# EAGLE design the_mill (EAGLE 7.1.0)
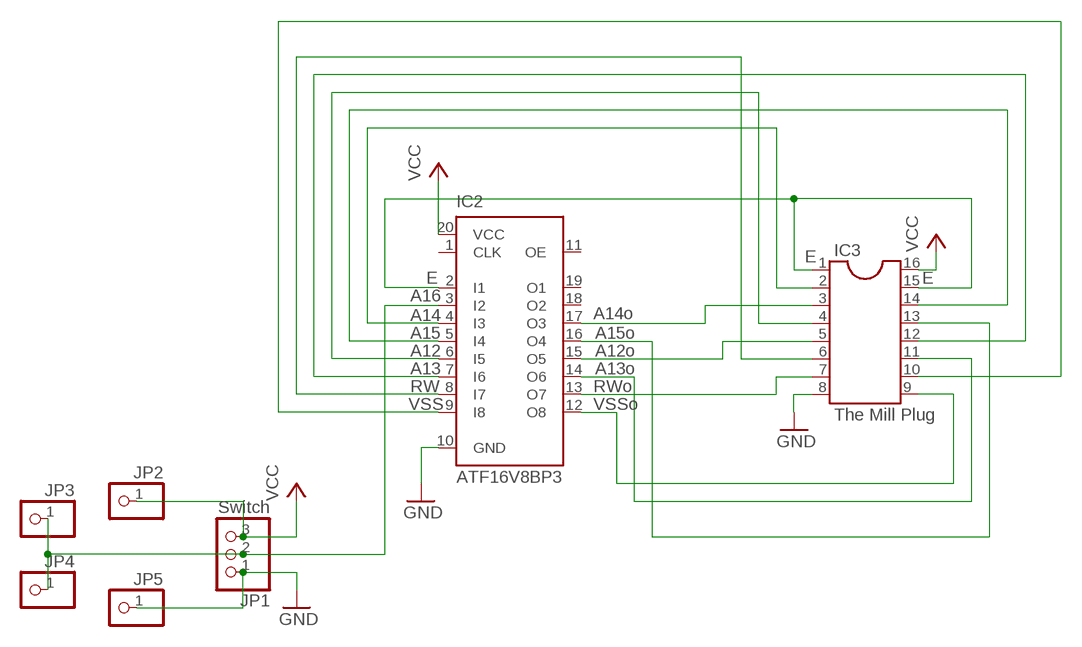
[diagram p0: schematic, sheet 1]

## Parts
IC2  ATF16V8BP3  [DIL20]
IC3  The Mill Plug  DIL16  [DIL16]
JP1  Switch  PINHD-1X3  [1X03]
JP2  PINHD-1X1  [1X01]
JP3  PINHD-1X1  [1X01]
JP4  PINHD-1X1  [1X01]
JP5  PINHD-1X1  [1X01]

## Nets
GND: IC2.10(GND) IC3.8 JP1.1 JP5.1
N$1: IC2.4(I3) IC3.2
N$2: IC2.5(I4) IC3.14
N$3: IC2.2(I1) IC3.1 IC3.15
N$4: IC2.6(I5) IC3.4
N$5: IC2.7(I6) IC3.12
N$6: IC2.3(I2) JP1.2 JP3.1 JP4.1
N$7: IC2.8(I7) IC3.6
N$8: IC2.9(I8) IC3.10
N$9: IC2.12(O8) IC3.9
N$10: IC2.13(O7) IC3.7
N$11: IC2.14(O6) IC3.11
N$12: IC2.15(O5) IC3.5
N$13: IC2.16(O4) IC3.13
N$14: IC2.17(O3) IC3.3
VCC: IC2.20(VCC) IC3.16 JP1.3 JP2.1
Unconnected: IC2.1(CLK) IC2.11(OE) IC2.18(O2) IC2.19(O1)

## Notes on the sheet
- E
- E | E
- A16
- A14 | A14o
- A15 | A15o
- A12 | A12o
- A13 | A13o
- RW | RWo
- VSS | VSSo

## Library data of the parts
IC2 = atmel:ATF16V8B: High perfomance CMOS (electrically erasable) programmable logic device (PLD) ABLE-Atmel-ABEL - P18V8R, P16V8C, P16V8AS, P17V8 COPL Atmel-WinCUPL - G16V8MS, G16V8MA, G16V8AS, G16V8 LOG/IC - GAL16V8_R, GAL16V8_G7, GAL16V8_C), GAL16V8 Tango-PLD - G16V8R, G16V8C, G16V8AS, G16V8 Source: http://www.atmel.com/dyn/resources/prod_documents/DOC0364.PDF; MPN: ATF16V8CZ-15PU; OC_FARNELL: 1551768; OC_NEWARK: 94M6254
IC3 = ic-package:DIL16: Dual In Line / Socket
JP1 = pinhead:PINHD-1X3: PIN HEADER
JP2-JP5 = pinhead:PINHD-1X1: PIN HEADER

## Board
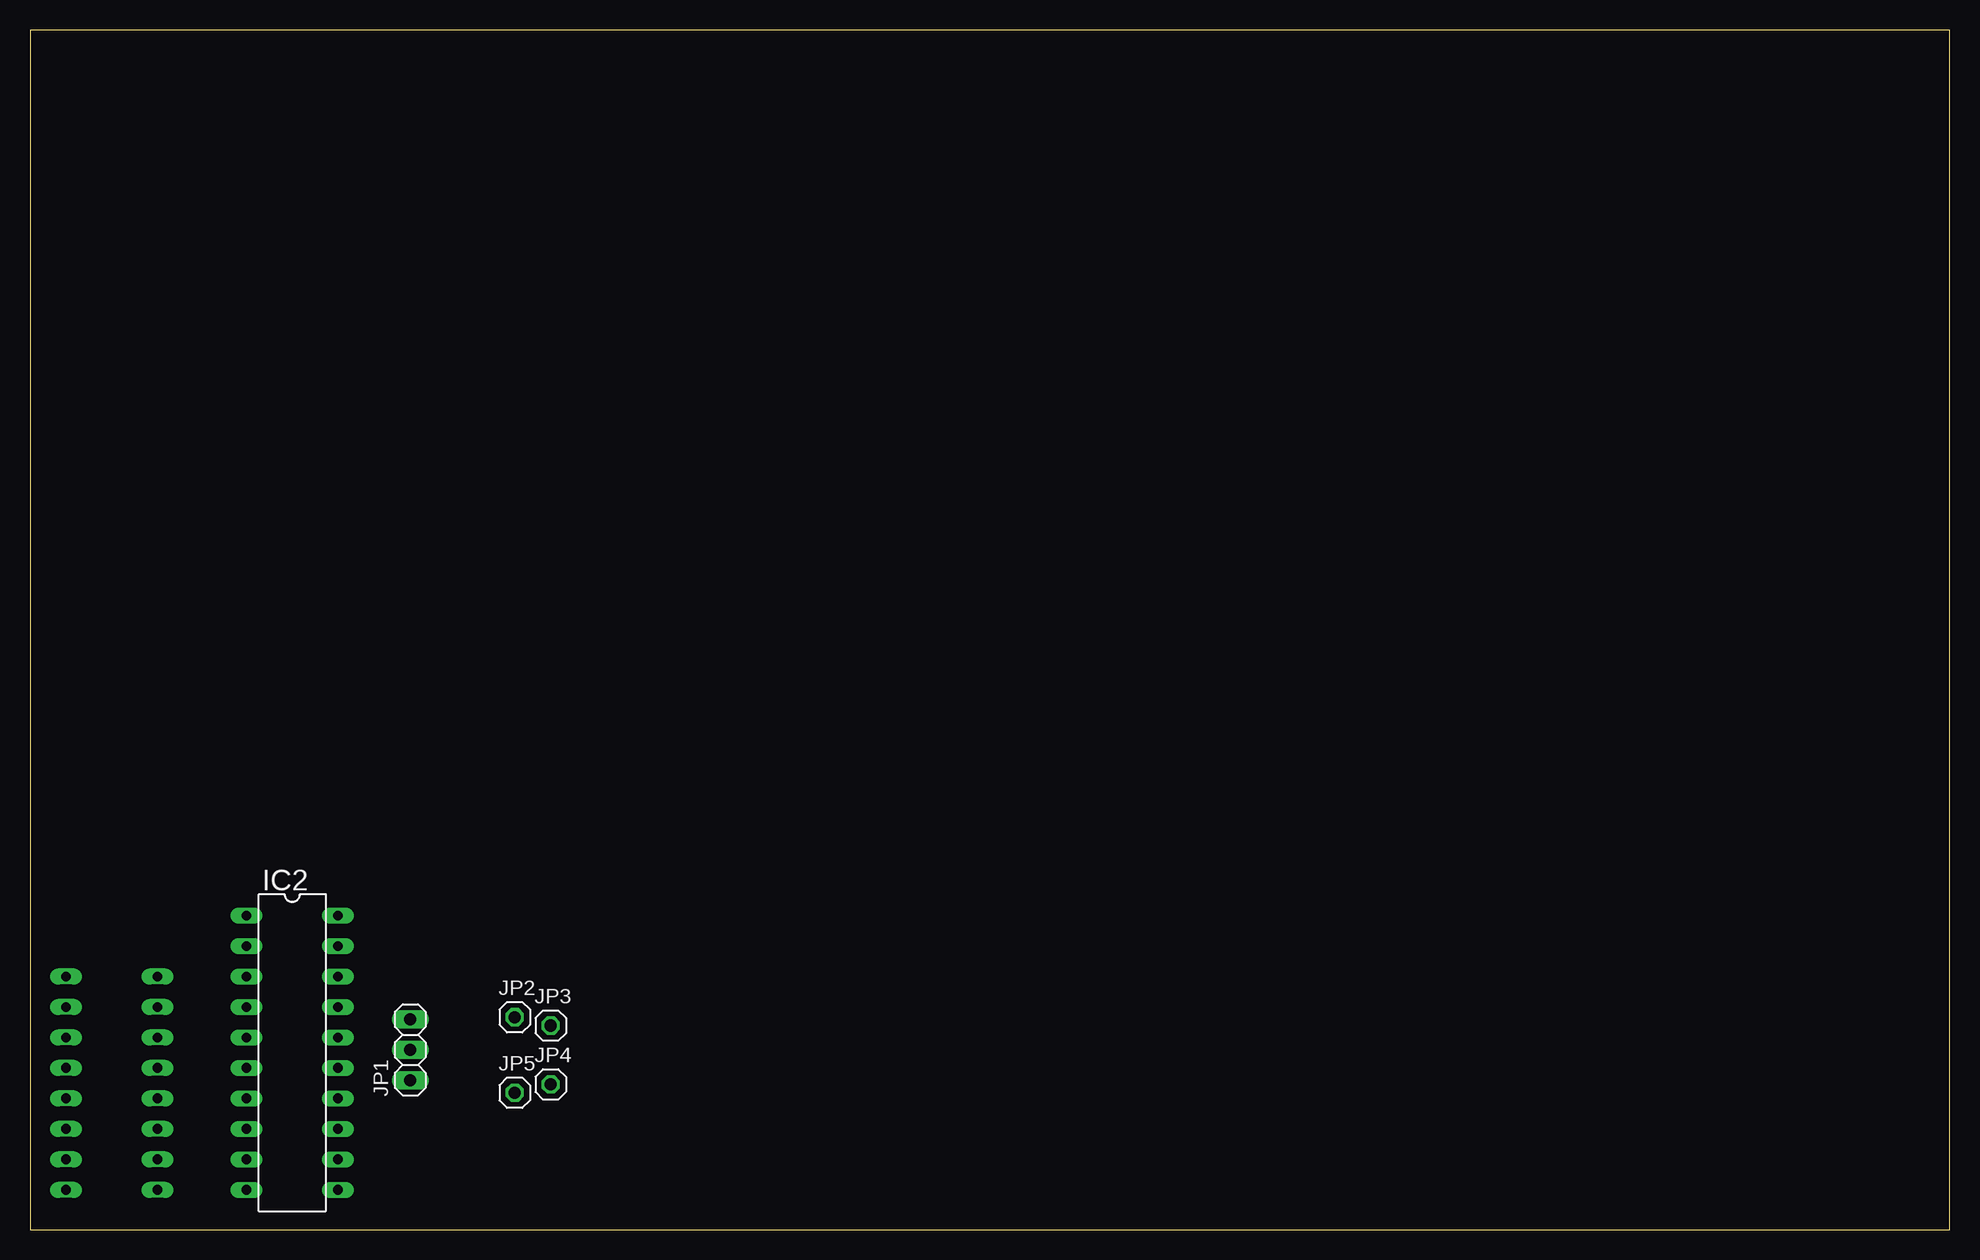
[diagram p1: board, top side]
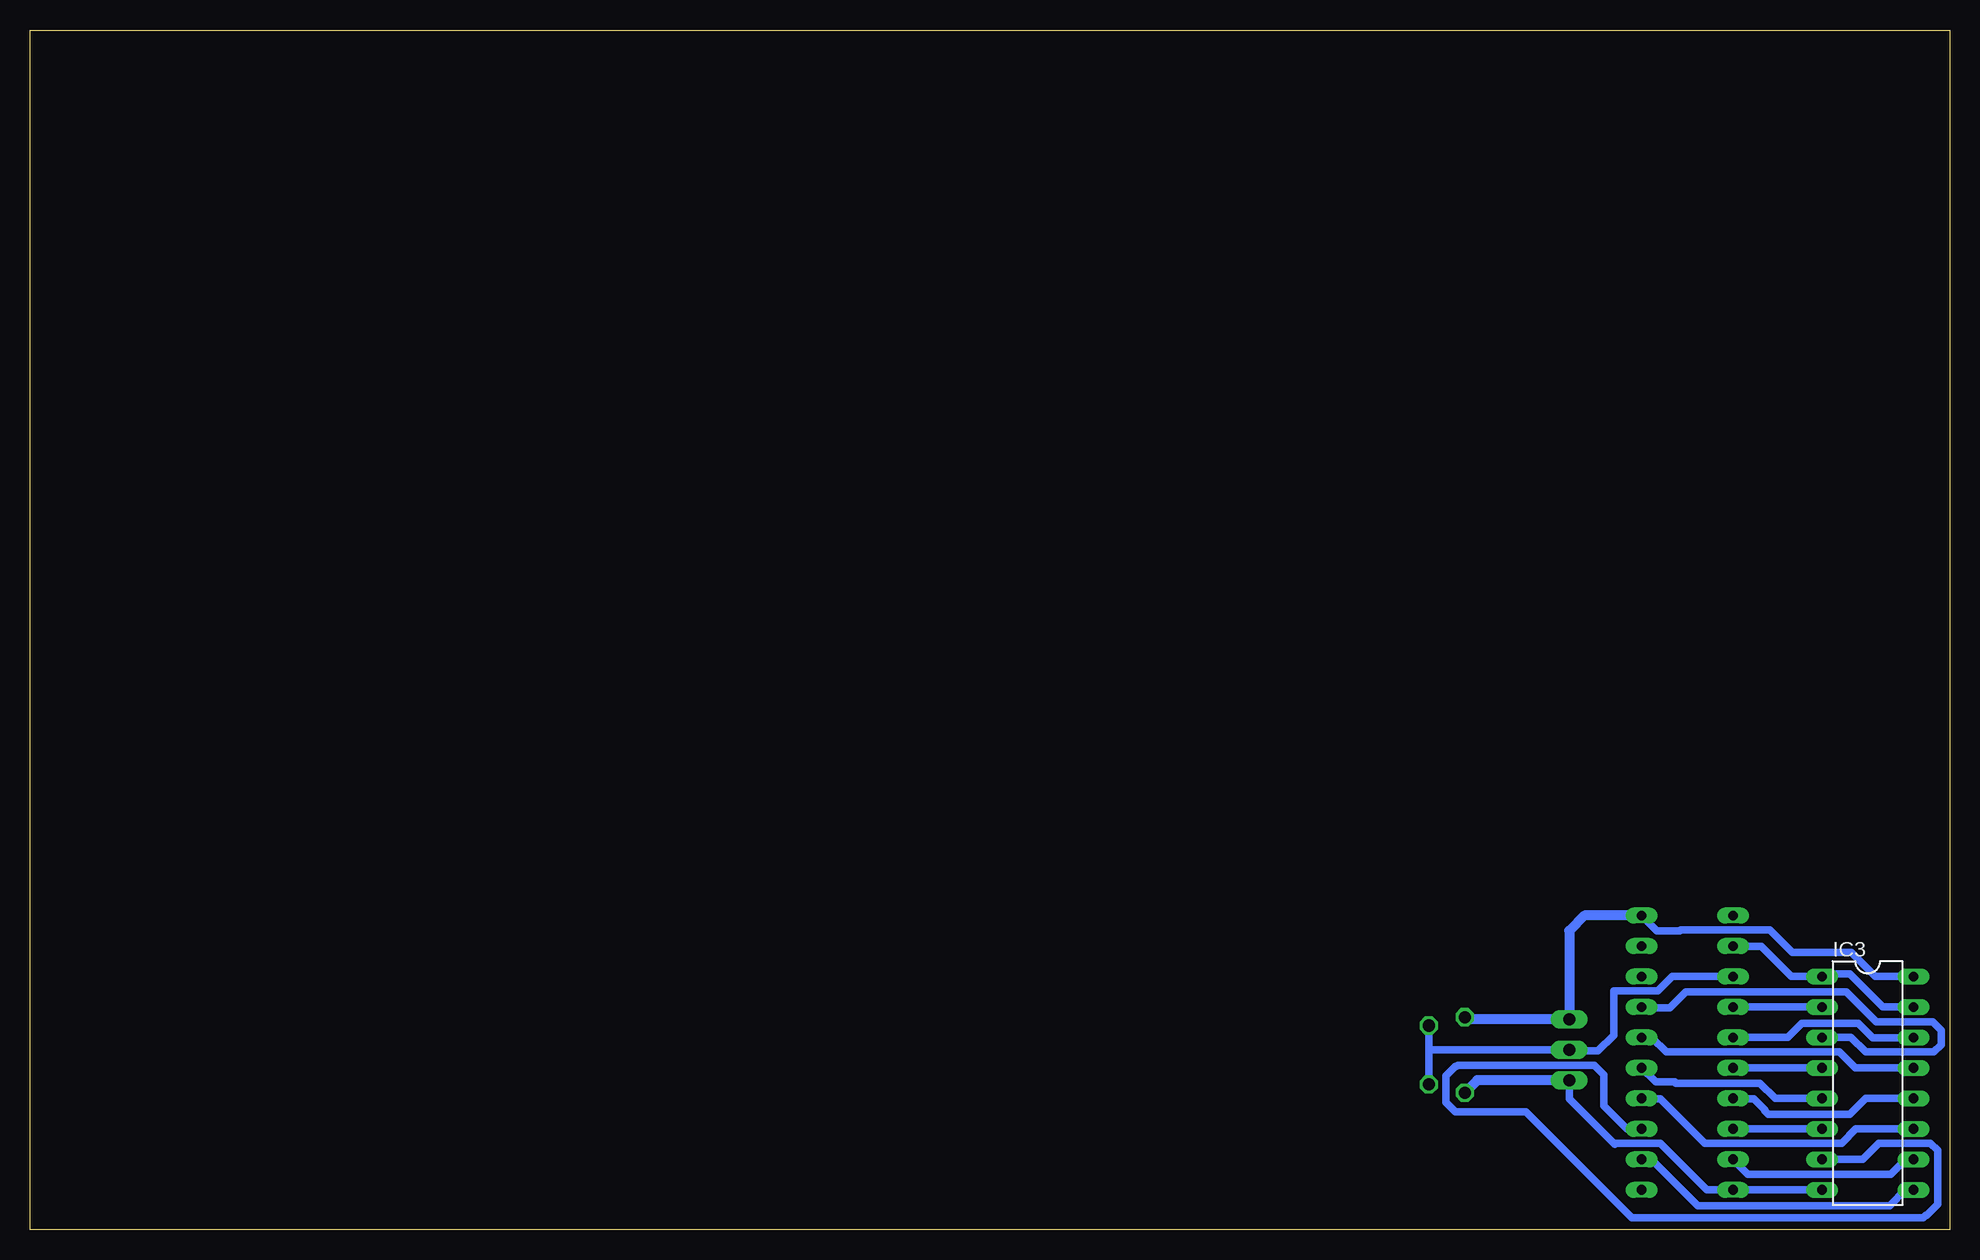
[diagram p2: board, bottom side, seen from below]

Size 160 x 100 mm. Coordinates in mm from the lower left corner, seen from the top.
Outline: 0,0 160,0 160,100 0,100 0,0
Copper layers (1*16): Top 0.035mm / dielectric 1.5mm / Bottom 0.035mm
Design rules "default": minimum track width 10mil, minimum drill 24mil, track to track 8mil, track to pad 8mil, pad to pad 8mil, via to via 8mil, smd to smd 8mil, copper to edge 40mil, drill to drill 8mil, minimum pad ring 10mil, minimum via ring 8mil, stop-mask expansion 4mil, vias tented up to drill 0mil, thermal gap 10mil

### Footprints (pad centres in the part's own frame; a part is rotated, then mirrored left to right if it is on the bottom)
DIL20 = drill 0.813 long: 1 -11.43,-3.81; 2 -8.89,-3.81; 3 -6.35,-3.81; 4 -3.81,-3.81; 5 -1.27,-3.81; 6 1.27,-3.81; 7 3.81,-3.81; 8 6.35,-3.81; 9 8.89,-3.81; 10 11.43,-3.81; 11 11.43,3.81; 12 8.89,3.81; 13 6.35,3.81; 14 3.81,3.81; 15 1.27,3.81; 16 -1.27,3.81; 17 -3.81,3.81; 18 -6.35,3.81; 19 -8.89,3.81; 20 -11.43,3.81
DIL16 = drill 0.813 long: 1 -8.89,-3.81; 2 -6.35,-3.81; 3 -3.81,-3.81; 4 -1.27,-3.81; 5 1.27,-3.81; 6 3.81,-3.81; 7 6.35,-3.81; 8 8.89,-3.81; 9 8.89,3.81; 10 6.35,3.81; 11 3.81,3.81; 12 1.27,3.81; 13 -1.27,3.81; 14 -3.81,3.81; 15 -6.35,3.81; 16 -8.89,3.81
1X03 = drill 1.016 long: 1 -2.54,0; 2 0,0; 3 2.54,0
1X01 = drill 1.016 octagon: 1 0,0

### Placement (x,y rotation side)
IC2  21.86,14.74 270 top
IC3  6.82,12.2 270 bottom
JP1  31.7,14.98 90 top
JP2  40.4,17.7 0 top
JP3  43.4,17 0 top
JP4  43.4,12.1 0 top
JP5  40.4,11.4 0 top

### Tracks (layer width: path | path; a pad name or v marks a point on that pad's centre or on a via)
GND
  Bottom 0.61: IC3.8 IC2.10 20.21,3.31 24.1,7.2 27.8,7.2 27.9,7.1 31.7,10.9 JP1.1
  Bottom 0.813: JP1.1 39.36,12.44 JP5.1
N$1
  Bottom 0.61: IC3.2 IC2.4
N$2
  Bottom 0.61: IC2.5 13.49,16.01 12.3,17.2 7.6,17.2 6.4,16 IC3.14
N$3
  Bottom 0.61: IC3.15 5.55,18.55 8.3,21.3 10.42,21.3 IC3.1 13.19,21.09 15.7,23.6 18.02,23.6 IC2.2
N$4
  Bottom 0.61: IC3.4 IC2.6
N$5
  Bottom 0.61: IC3.12 6.97,10.93 8.3,9.6 15.1,9.6 15.4,9.9 15.4,10 16.3,10.9 18.02,10.9 IC2.7
N$6
  Bottom 0.61: IC2.3 23.11,21.09 24.3,19.9 28,19.9 28,16.2 29.3,14.9 31.62,14.9 JP1.2 31.98,14.98 32,15 43.4,15 | JP3.1 43.4,15 | 43.4,15 JP4.1
N$7
  Bottom 0.61: IC3.6 IC2.8
N$8
  Bottom 0.61: IC3.10 3.65,5.85 4.9,4.6 16.8,4.6 IC2.9
N$9
  Bottom 0.61: IC3.9 3.69,3.31 5,2 21,2 25,6 25.52,6 IC2.12
N$10
  Bottom 0.61: IC3.7 7.25,5.85 5.9,7.2 1.6,7.2 1,6.6 1,2.1 1.9,1.2 2,1.2 2.2,1 26.5,1 35.3,9.8 41.2,9.8 42,10.6 42,12.8 41.2,13.6 41.1,13.6 41,13.7 29.6,13.7 28.8,12.9 28.8,10.3 26.9,8.4 IC2.13
N$11
  Bottom 0.61: IC3.11 7.81,8.39 9,7.2 20.4,7.2 24.1,10.9 25.64,10.9 IC2.14
N$12
  Bottom 0.61: IC3.5 14.53,10.93 15.8,12.2 22.8,12.2 22.9,12.3 24.5,12.3 IC2.15
N$13
  Bottom 0.61: IC3.13 7.87,13.47 9.2,14.8 23.6,14.8 24.8,16 IC2.16
N$14
  Bottom 0.61: IC3.3 8.21,16.01 7,14.8 1.3,14.8 0.7,15.4 0.7,16.6 1.4,17.3 6.1,17.3 8.6,19.8 22,19.8 23.3,18.5 25.62,18.5 IC2.17
VCC
  Bottom 0.61: IC3.16 6.19,21.09 8.2,23.1 13.1,23.1 15,25 22.4,25 22.5,24.9 24.4,24.9 IC2.20
  Bottom 0.813: IC2.20 30.43,26.17 31.7,24.9 JP1.3 40.22,17.52 JP2.1

### Text on the board
Pads: OS9 | OFF